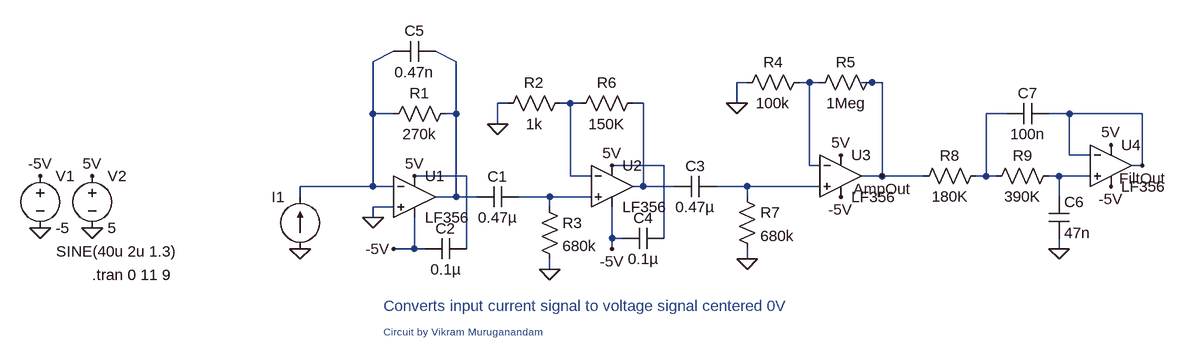
[diagram p0: schematic SigAmpHigh.asc]
SigAmpHigh.asc, the LTspice schematic file:
Version 4
SHEET 1 1496 680
WIRE 256 -32 288 -48
WIRE 384 -32 352 -48
WIRE 832 0 816 0
WIRE 928 0 912 0
WIRE 944 0 928 0
WIRE 1024 0 1008 0
WIRE 1040 0 1024 0
WIRE 464 32 448 32
WIRE 560 32 544 32
WIRE 576 32 560 32
WIRE 672 32 656 32
WIRE 816 32 816 0
WIRE 256 48 256 -32
WIRE 288 48 256 48
WIRE 384 48 384 -32
WIRE 384 48 368 48
WIRE 1232 48 1200 48
WIRE 1328 48 1296 48
WIRE 1440 48 1328 48
WIRE 448 64 448 32
WIRE 1328 112 1328 48
WIRE 1360 112 1328 112
WIRE 704 128 624 128
WIRE 928 128 928 0
WIRE 944 128 928 128
WIRE 1440 128 1440 48
WIRE 1440 128 1424 128
WIRE 400 144 320 144
WIRE 560 144 560 32
WIRE 592 144 560 144
WIRE 1040 144 1040 0
WIRE 1040 144 1008 144
WIRE 1104 144 1040 144
WIRE 1200 144 1200 48
WIRE 1200 144 1184 144
WIRE 1216 144 1200 144
WIRE 1312 144 1296 144
WIRE 1360 144 1312 144
WIRE 256 160 256 48
WIRE 256 160 144 160
WIRE 288 160 256 160
WIRE 672 160 672 32
WIRE 672 160 656 160
WIRE 720 160 672 160
WIRE 832 160 784 160
WIRE 944 160 832 160
WIRE 144 176 144 160
WIRE 384 176 384 48
WIRE 384 176 352 176
WIRE 416 176 384 176
WIRE 528 176 480 176
WIRE 592 176 528 176
WIRE 832 176 832 160
WIRE 1312 176 1312 144
WIRE 288 192 256 192
WIRE 528 192 528 176
WIRE 256 208 256 192
WIRE 624 240 624 192
WIRE 640 240 624 240
WIRE 704 240 704 128
WIRE 320 256 320 208
WIRE 320 256 288 256
WIRE 336 256 320 256
WIRE 400 256 400 144
WIRE 624 256 624 240
WIRE 1312 256 1312 240
WIRE 832 272 832 256
WIRE 528 288 528 272
FLAG -256 224 0
FLAG -176 224 0
FLAG -176 144 5V
FLAG 320 144 5V
FLAG -256 144 -5V
FLAG 288 256 -5V
FLAG 256 208 0
FLAG 144 256 0
FLAG 624 128 5V
FLAG 624 256 -5V
FLAG 976 176 -5V
FLAG 976 112 5V
FLAG 528 288 0
FLAG 448 64 0
FLAG 832 272 0
FLAG 816 32 0
FLAG 1040 144 AmpOut
FLAG 1312 256 0
FLAG 1392 96 5V
FLAG 1392 160 -5V
FLAG 1440 128 FiltOut
SYMBOL LF356 320 112 R0
SYMATTR InstName U1
SYMBOL voltage -256 128 R0
WINDOW 123 0 0 Left 0
WINDOW 39 0 0 Left 0
SYMATTR InstName V1
SYMATTR Value -5
SYMBOL voltage -176 128 R0
WINDOW 123 0 0 Left 0
WINDOW 39 0 0 Left 0
SYMATTR InstName V2
SYMATTR Value 5
SYMBOL current 144 256 R180
WINDOW 0 24 80 Left 2
WINDOW 3 189 -4 Left 2
WINDOW 123 0 0 Left 0
WINDOW 39 0 0 Left 0
SYMATTR InstName I1
SYMATTR Value SINE(40u 2u 1.3)
SYMBOL res 384 32 R90
WINDOW 0 0 56 VBottom 2
WINDOW 3 32 56 VTop 2
SYMATTR InstName R1
SYMATTR Value 270k
SYMBOL cap 480 160 R90
WINDOW 0 0 32 VBottom 2
WINDOW 3 32 32 VTop 2
SYMATTR InstName C1
SYMATTR Value 0.47µ
SYMBOL LF356 624 96 R0
SYMATTR InstName U2
SYMBOL LF356 976 80 R0
SYMATTR InstName U3
SYMBOL res 1040 -16 R90
WINDOW 0 0 56 VBottom 2
WINDOW 3 32 56 VTop 2
SYMATTR InstName R5
SYMATTR Value 1Meg
SYMBOL res 672 16 R90
WINDOW 0 0 56 VBottom 2
WINDOW 3 32 56 VTop 2
SYMATTR InstName R6
SYMATTR Value 150K
SYMBOL cap 400 240 R90
WINDOW 0 0 32 VBottom 2
WINDOW 3 32 32 VTop 2
SYMATTR InstName C2
SYMATTR Value 0.1µ
SYMBOL res 512 176 R0
SYMATTR InstName R3
SYMATTR Value 680k
SYMBOL res 560 16 R90
WINDOW 0 0 56 VBottom 2
WINDOW 3 32 56 VTop 2
SYMATTR InstName R2
SYMATTR Value 1k
SYMBOL cap 784 144 R90
WINDOW 0 0 32 VBottom 2
WINDOW 3 32 32 VTop 2
SYMATTR InstName C3
SYMATTR Value 0.47µ
SYMBOL res 816 160 R0
SYMATTR InstName R7
SYMATTR Value 680k
SYMBOL cap 704 224 R90
WINDOW 0 0 32 VBottom 2
WINDOW 3 32 32 VTop 2
SYMATTR InstName C4
SYMATTR Value 0.1µ
SYMBOL res 928 -16 R90
WINDOW 0 0 56 VBottom 2
WINDOW 3 32 56 VTop 2
SYMATTR InstName R4
SYMATTR Value 100k
SYMBOL cap 352 -64 R90
WINDOW 0 0 32 VBottom 2
WINDOW 3 32 32 VTop 2
SYMATTR InstName C5
SYMATTR Value 0.47n
SYMBOL res 1200 128 R90
WINDOW 0 0 56 VBottom 2
WINDOW 3 32 56 VTop 2
SYMATTR InstName R8
SYMATTR Value 180K
SYMBOL res 1312 128 R90
WINDOW 0 0 56 VBottom 2
WINDOW 3 32 56 VTop 2
SYMATTR InstName R9
SYMATTR Value 390K
SYMBOL LF356 1392 64 R0
SYMATTR InstName U4
SYMBOL cap 1296 176 R0
SYMATTR InstName C6
SYMATTR Value 47n
SYMBOL cap 1296 32 R90
WINDOW 0 0 32 VBottom 2
WINDOW 3 32 32 VTop 2
SYMATTR InstName C7
SYMATTR Value 100n
TEXT -176 296 Left 2 !.tran 0 11 9
TEXT 272 384 Left 1 ;Circuit by Vikram Muruganandam
TEXT 272 344 Left 2 ;Converts input current signal to voltage signal centered 0V

The netlist it stands for:
* SigAmpHigh.asc
XU1 0 N001 5V -5V N002 LF356  ; pins In+ In- V+ V- OUT
V1 -5V 0 -5
V2 5V 0 5
I1 0 N001 SINE(40u 2u 1.3)
R1 N002 N001 270k
C1 N009 N002 0.47µ
XU2 N009 N004 5V -5V N005 LF356  ; pins In+ In- V+ V- OUT
XU3 N008 N003 5V -5V AmpOut LF356  ; pins In+ In- V+ V- OUT
R5 AmpOut N003 1Meg
R6 N005 N004 150K
C2 5V -5V 0.1µ
R3 N009 0 680k
R2 N004 0 1k
C3 N008 N005 0.47µ
R7 N008 0 680k
C4 5V -5V 0.1µ
R4 N003 0 100k
C5 N002 N001 0.47n
R8 N006 AmpOut 180K
R9 N007 N006 390K
XU4 N007 FiltOut 5V -5V FiltOut LF356  ; pins In+ In- V+ V- OUT
C6 N007 0 47n
C7 FiltOut N006 100n
.tran 0 11 9
* Circuit by Vikram Muruganandam
* Converts input current signal to voltage signal centered 0V
.lib LF356.sub
.backanno
.end